# Altium schematic sheet MCU_POWER.SchDoc: STM32 microcontroller Power
size 420 x 297 mm; CompanyName: STMicroelectronics; Organization: Microcontrollers Division; DocumentNumber: 5; SheetNumber: 4; SheetTotal: 19
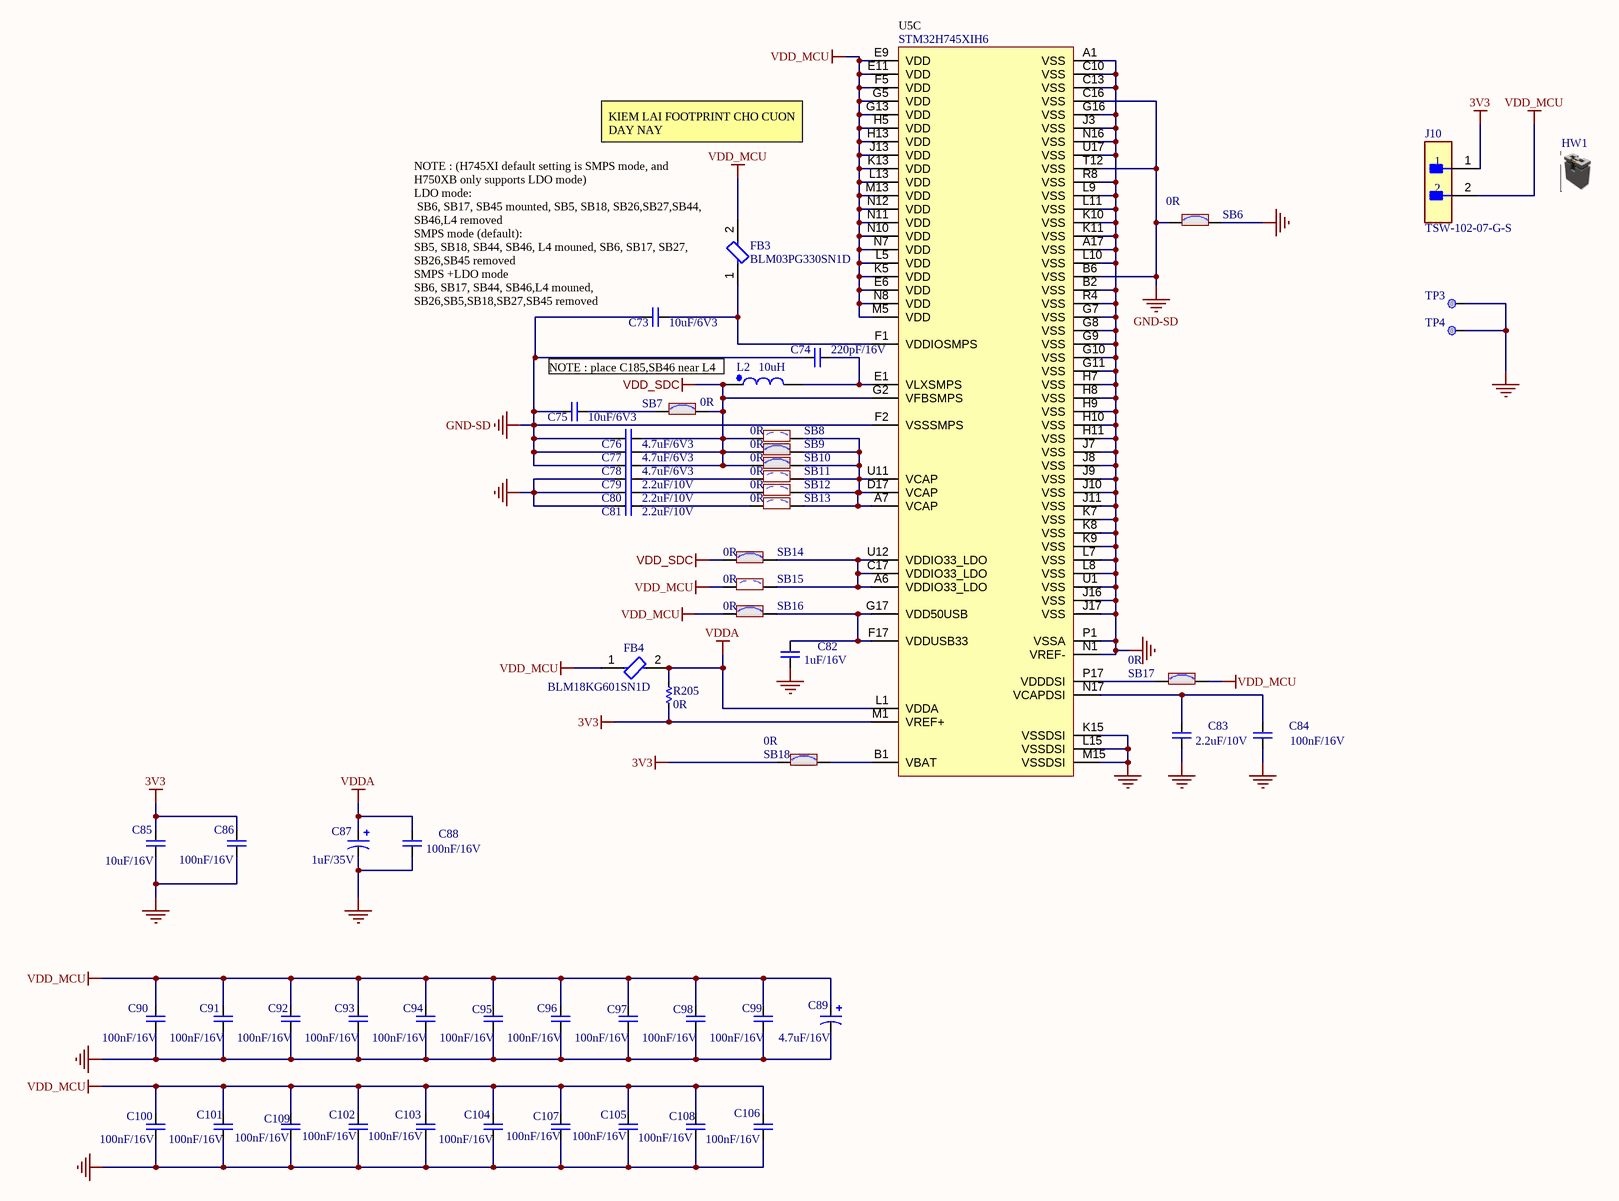
[diagram p0: MCU_POWER.SchDoc]

## Parts
C73  10uF/6V3  [CAP_C_1608X80]
C74  220pF/16V  [CAP_C_1608X80]
C75  10uF/6V3  [CAP_C_1608X80]
C76  4.7uF/6V3  [CAP_C_1608X80]
C77  4.7uF/6V3  [CAP_C_1608X80]
C78  4.7uF/6V3  [CAP_C_1608X80]
C79  2.2uF/10V  [CAP_C_1608X80]
C80  2.2uF/10V  [CAP_C_1608X80]
C81  2.2uF/10V  [CAP_C_1608X80]
C82  1uF/16V  [CAP_C_1608X80]
C83  2.2uF/10V  [CAP_C_1608X80]
C84  100nF/16V  [CAP_C_1608X80]
C85  10uF/16V  [CAP_C_1608X80]
C86  100nF/16V  [CAP_C_1608X80]
C87  1uF/35V  [CAP_MP_1608X90]
C88  100nF/16V  [CAP_C_1608X80]
C89  4.7uF/16V  [CAP_MP_1608X90]
C90  100nF/16V  [CAP_C_1608X80]
C91  100nF/16V  [CAP_C_1608X80]
C92  100nF/16V  [CAP_C_1608X80]
C93  100nF/16V  [CAP_C_1608X80]
C94  100nF/16V  [CAP_C_1608X80]
C95  100nF/16V  [CAP_C_1608X80]
C96  100nF/16V  [CAP_C_1608X80]
C97  100nF/16V  [CAP_C_1608X80]
C98  100nF/16V  [CAP_C_1608X80]
C99  100nF/16V  [CAP_C_1608X80]
C100  100nF/16V  [CAP_C_1608X80]
C101  100nF/16V  [CAP_C_1608X80]
C102  100nF/16V  [CAP_C_1608X80]
C103  100nF/16V  [CAP_C_1608X80]
C104  100nF/16V  [CAP_C_1608X80]
C105  100nF/16V  [CAP_C_1608X80]
C106  100nF/16V  [CAP_C_1608X80]
C107  100nF/16V  [CAP_C_1608X80]
C108  100nF/16V  [CAP_C_1608X80]
C109  100nF/16V  [CAP_C_1608X80]
FB3  BLM03PG330SN1D  [FP-BLM03-0_03-d0_3-IPC_C]
FB4  BLM18KG601SN1D  [FP-BLM18-0_15-t0_8-IPC_A]
HW1  Shunt 2.54mm  [N/A]  (value not drawn)  (mechanical)
J10  TSW-102-07-G-S  [FP-TSW-102-07-G-S-MFG]
L2  10uH  [INDC1608X95N]
R205  0R  [RES_C_1608X60]
SB6  value 0R  [Jump2]  (hidden comment: SB_ON)
SB7  value 0R  [Jump2]  (hidden comment: SB_ON)
SB8  value 0R  [Jump2]  (hidden comment: SB_OFF)
SB9  value 0R  [Jump2]  (hidden comment: SB_ON)
SB10  value 0R  [Jump2]  (hidden comment: SB_ON)
SB11  value 0R  [Jump2]  (hidden comment: SB_OFF)
SB12  value 0R  [Jump2]  (hidden comment: SB_OFF)
SB13  value 0R  [Jump2]  (hidden comment: SB_OFF)
SB14  value 0R  [Jump2]  (hidden comment: SB_ON)
SB15  value 0R  [Jump2]  (hidden comment: SB_OFF)
SB16  value 0R  [Jump2]  (hidden comment: SB_ON)
SB17  value 0R  [Jump2]  (hidden comment: SB_ON)
SB18  value 0R  [Jump2]  (hidden comment: SB_ON)
TP3  Test Point  [TESTPOINT]  (value not drawn)  (no BOM)
TP4  Test Point  [TESTPOINT]  (value not drawn)  (no BOM)
U5  value STM32H745XIH6  [TFBGA240+25]  (part C of 3)

## Nets
3V3: C85.2 C86.2 J10.1 R205.1 SB18.1 U5.M1(VREF+)
GND: C79.2 C80.2 C81.2 C82.1 C83.1 C84.1 C85.1 C86.1 C87.2 C88.1 C89.2 C90.1 C91.1 C92.1 C93.1 C94.1 C95.1 C96.1 C97.1 C98.1 C99.1 C100.1 C101.1 C102.1 C103.1 C104.1 C105.1 C106.1 C107.1 C108.1 C109.1 SB6.2 TP3.1 TP4.1 U5.A1(VSS) U5.A17(VSS) U5.B2(VSS) U5.C10(VSS) U5.C13(VSS) U5.G7(VSS) U5.G8(VSS) U5.G9(VSS) U5.G10(VSS) U5.G11(VSS) U5.G16(VSS) U5.H7(VSS) U5.H8(VSS) U5.H9(VSS) U5.H10(VSS) U5.H11(VSS) U5.J3(VSS) U5.J7(VSS) U5.J8(VSS) U5.J9(VSS) U5.J10(VSS) U5.J11(VSS) U5.J16(VSS) U5.J17(VSS) U5.K7(VSS) U5.K8(VSS) U5.K9(VSS) U5.K10(VSS) U5.K11(VSS) U5.K15(VSSDSI) U5.L7(VSS) U5.L8(VSS) U5.L9(VSS) U5.L10(VSS) U5.L11(VSS) U5.L15(VSSDSI) U5.M15(VSSDSI) U5.N1(VREF-) U5.N16(VSS) U5.P1(VSSA) U5.R4(VSS) U5.R8(VSS) U5.U1(VSS) U5.U17(VSS)
GND-SD: C73.2 C74.2 C75.2 C76.2 C77.2 C78.2 SB6.1 U5.B6(VSS) U5.C16(VSS) U5.F2(VSSSMPS) U5.T12(VSS)
VDD_MCU: C89.1 C90.2 C91.2 C92.2 C93.2 C94.2 C95.2 C96.2 C97.2 C98.2 C99.2 C100.2 C101.2 C102.2 C103.2 C104.2 C105.2 C106.2 C107.2 C108.2 C109.2 FB3.2 FB4.1 J10.2 SB15.1 SB16.1 SB17.2 U5.E6(VDD) U5.E9(VDD) U5.E11(VDD) U5.F5(VDD) U5.G5(VDD) U5.G13(VDD) U5.H5(VDD) U5.H13(VDD) U5.J13(VDD) U5.K5(VDD) U5.K13(VDD) U5.L5(VDD) U5.L13(VDD) U5.M5(VDD) U5.M13(VDD) U5.N7(VDD) U5.N8(VDD) U5.N10(VDD) U5.N11(VDD) U5.N12(VDD)
VDD_SDC: C76.1 C77.1 C78.1 L2.1 SB7.2 SB8.1 SB9.1 SB10.1 SB14.1 U5.G2(VFBSMPS)
VDDA: C87.1 C88.2 FB4.2 R205.2 U5.L1(VDDA)
NetC73_1: C73.1 FB3.1 U5.F1(VDDIOSMPS)
NetC74_1: C74.1 L2.2 U5.E1(VLXSMPS)
NetC75_1: C75.1 SB7.1
NetC79_1: C79.1 SB11.1
NetC80_1: C80.1 SB12.1
NetC81_1: C81.1 SB13.1
NetC82_2: C82.2 SB16.2 U5.F17(VDDUSB33) U5.G17(VDD50USB)
NetC83_2: C83.2 C84.2 U5.N17(VCAPDSI)
NetSB8_2: SB8.2 SB9.2 SB10.2 SB11.2 SB12.2 SB13.2 U5.A7(VCAP) U5.D17(VCAP) U5.U11(VCAP)
NetSB14_2: SB14.2 SB15.2 U5.A6(VDDIO33_LDO) U5.C17(VDDIO33_LDO) U5.U12(VDDIO33_LDO)
NetSB17_1: SB17.1 U5.P17(VDDDSI)
NetSB18_2: SB18.2 U5.B1(VBAT)

## Notes on the sheet
- KIEM LAI FOOTPRINT CHO CUON DAY NAY
- (near C73) NOTE : (H745XI default setting is SMPS mode, and H750XB only supports LDO mode)
  LDO mode:
  SB6, SB17, SB45 mounted, SB5, SB18, SB26,SB27,SB44, SB46,L4 removed
  SMPS mode (default):
  SB5, SB18, SB44, SB46, L4 mouned, SB6, SB17, SB27, SB26,SB45 removed
  SMPS +LDO mode
  SB6, SB17, SB44, SB46,L4 mouned, SB26,SB5,SB18,SB27,SB45 removed
- (near L2) NOTE : place C185,SB46 near L4
- Sub-system:
- Project:
- Design by:
- Sheet title:
- Sheet
- of
- Checked by:
- Approved by:
- Doc no:
- Revision
- Size:
- Date:

## Library data of the parts
C73-C86 C88 C90-C109 = CAP_SMD: CAP_Chip; Value: 33pF
C87 C89 = _CAP_Pola_2: CAP Polarization
FB3 = CMP-0686-00117-3: Ferrite Bead, 0201, 33Ω @ 100MHz, 25%, 0.09Ω, 750mA; Number of Lines: 1; Material: Steel; Impedance: 33R; DC Resistance (DCR): 90mR; Package Quantity: 1; Lead Free: Lead Free; Packaging: Tape and Reel; Case Code (Metric): 0603; Max DC Current: 750mA; Number of Pins: 2; Current Rating: 750mA; Case/Package: 0201; Termination: SMD/SMT; Tolerance: 25%; Series: BLM03P; Min Operating Temperature: -55°C; Test Frequency: 100MHz; Max Operating Temperature: 125°C; Width: 0.3mm; REACH SVHC: No SVHC; Max Current Rating: 750mA; Height: 0.3mm; Case Code (Imperial): 0201; RoHS Compliant: Yes; Length: 0.6mm; Number of Circuits: 1
FB4 = CMP-0686-00581-3: Chip Ferrite Bead, 0603, 600Ω @ 100MHz, 0.15Ω, 25%, 1.3A; Material: Steel; Number of Lines: 1; Impedance: 600R; DC Resistance (DCR): 150mR; Tolerance: 25%; Case Code (Metric): 1608; Width: 0.8mm; DC Current: 1.3A; Max DC Current: 1.3A; Package Quantity: 1; Number of Pins: 2; Military Standard: Not; RoHS Compliant: Yes; Termination: SMD/SMT; Max Operating Temperature: 125°C; Length: 1.6mm; Depth: 0.8mm; Case Code (Imperial): 0603; Series: BLM18K; Inductor Type: FERRITE BEAD; Core Material: Ferrite; Number of Circuits: 1; Height: 0.8mm; Case/Package: 0603; REACH SVHC: No SVHC; Packaging: Tape and Reel; Min Operating Temperature: -55°C; Max Current Rating: 1.3A; Radiation Hardening: No; Current Rating: 1.3A; Lead Free: Lead Free; Test Frequency: 100MHz; Weight: 7.1E-05oz
HW1 = MCD-00043: SHUNT 2.54mm BLACK; Manufacturer_Part_Number: SNT-100-BK-G; Manufacturer: SAMTEC; Full_Alternate_Internal_Part_Number: MCD-02388; Manufacturer_HQ_COO: Unknown; Part_Preference: Recommended; Part_Type: Misc; Partial_Alternate_Internal_Part_Number: MCD-01849, MCD-01864; Provided_By: Subcon; Alternate_EMS: A; Component_Country_Of_Origin: China, Costa Rica, Malaysia, USA, Vietnam; ID: 2551; Order_Code_RS: 158-7784; ShowFields: YES; Value: SNT-100-BK-G; Internal_Part_Number: MCD-00043; PartType: Mechanical; ECCN_US: n/a; ECCN_EU: n/a; ComponentLink1Description: Samtec_Shunt_Jumper_SNT100.pdf; ComponentLink1URL: http://tunmcdsvn.tun.st.com/Component_Documentation_Library/Trunk/Misc/SAMTEC_SNT-100-BK-G; Order_Code_Digikey: SAM8858-ND; Order_Code_Farnell: 2505007; Package: 2.54x5.08mm; Status: Released
J10 = CMP-02766-000084-1: CONN HEADER VERT 2POS 2.54MM; Manufacturer: Samtec; Number Of Contacts: 2; Voltage Rating: 550V; Conn Orientation: Straight; Current Rating: 6.3A; Conn Gender: Male; Package: TSW-102-07-G-S; Digikey Description: CONN HEADER VERT 2POS 2.54MM; ComponentLink2URL: http://suddendocs.samtec.com/catalog_english/tsw_th.pdf; Height: 8.71mm; Temperature: -55°C to +125°C; Device Class L2: Headers and Wire Housings; ComponentLink2Description: Datasheet; Device Class L3: unset; Contact Material: Gold,Nickel; Temperature Range Low: -55°C; Temperature Range High: +125°C; RoHS: TRUE; Device Class L1: Connectors; Mouser Description: Conn Unshrouded Header HDR 2 POS 2.54mm Solder ST Thru-Hole Automotive Bulk; Number Of Rows: 1; Category: Conn; Pitch: 2.54mm; Lead Free: Yes; Automotive: No; Manufacturer Part Number: TSW-102-07-G-S; Footprint Url: http://suddendocs.samtec.com/prints/tsw-xxx-xx-x-x-xx-xxx-footprint.pdf; Octopart: https://octopart.com/tsw-102-07-g-s-samtec-272197
L2 = _IND: FIXED IND 10UH 300MA 600MOHM SMD
R205 = _RES_B_2: RES
SB6 SB7 SB9 SB10 SB14 SB16-SB18 = MCD-00071: Solder Bridge ON; Part_Type: Resistor; Manufacturer: YAGEO; Manufacturer_HQ_COO: Unknown; Manufacturer_Part_Number: RC0603JR-070RL; Part_Preference: Recommended; Provided_By: Subcon; Initial_Board_Reference: mb1274; Component_Country_Of_Origin: China; ID: 2521; Order_Code_RS: 199-5647; ShowFields: YES; Internal_Part_Number: MCD-00071; ECCN_US: n/a; ECCN_EU: n/a; Status: Released; ComponentLink1URL: http://tunmcdsvn.tun.st.com/Component_Documentation_Library/Trunk/Resistor/YAGEO_RC_Series; Order_Code_Digikey: 311-0.0GRTR-ND; Order_Code_Farnell: 2421846; Package: 0603
SB8 SB11-SB13 SB15 = MCD-00072: Solder Bridge OFF; Part_Type: Resistor; Manufacturer: YAGEO; Manufacturer_HQ_COO: Unknown; Manufacturer_Part_Number: RC0603JR-070RL; Part_Preference: Recommended; Initial_Board_Reference: mb1274; Component_Country_Of_Origin: China; ID: 2520; Order_Code_RS: 199-5647; ShowFields: YES; Internal_Part_Number: MCD-00072; Status: Released; ECCN_US: n/a; ECCN_EU: n/a; Provided_By: n/a; ComponentLink1URL: http://tunmcdsvn.tun.st.com/Component_Documentation_Library/Trunk/Resistor/YAGEO_RC_Series; Order_Code_Digikey: 311-0.0GRTR-ND; Order_Code_Farnell: 2421846; Package: 0603
TP3 TP4 = MCD-00630: Test Point 0.3mm; Part_Type: Misc; Part_Preference: Recommended; Initial_Board_Reference: MB1264; ID: 3115; ShowFields: YES; Component_Country_Of_Origin: Unknown; Internal_Part_Number: MCD-00630; Status: Released; ECCN_US: n/a; ECCN_EU: n/a; Provided_By: n/a; Manufacturer: N/A; Manufacturer_Part_Number: N/A; Order_Code_Digikey: N/A; Order_Code_Farnell: N/A; Order_Code_RS: N/A; ComponentLink1URL: http://tunmcdsvn.tun.st.com/Component_Documentation_Library/Trunk; Manufacturer_HQ_COO: Unknown
U5 = MCD-01085: 32bit MCU TFBGA240+25; Part_Type: IC; Manufacturer: STMICROELECTRONICS; BMS_Part_Number: 9175307; Manufacturer_HQ_COO: EU; Part_Preference: Recommended; Provided_By: STM; Initial_Board_Reference: MB1381; Component_Country_Of_Origin: Philippines; ID: 3408; ShowFields: YES; Internal_Part_Number: MCD-01085; Status: Checked; Manufacturer_Part_Number: STM32H745XIH6; Package: TFBGA-265; ComponentLink1Description: Datasheet; ComponentLink1URL: http://tunmcdsvn.tun.st.com/Component_Documentation_Library/Trunk/IC/STMICROELECTRONICS_STM32H745x; Order_Code_Digikey: 497-19502-ND; Order_Code_Farnell: 3365366; Order_Code_RS: N/A